# EAGLE schematic logika (EAGLE 7.2.0)
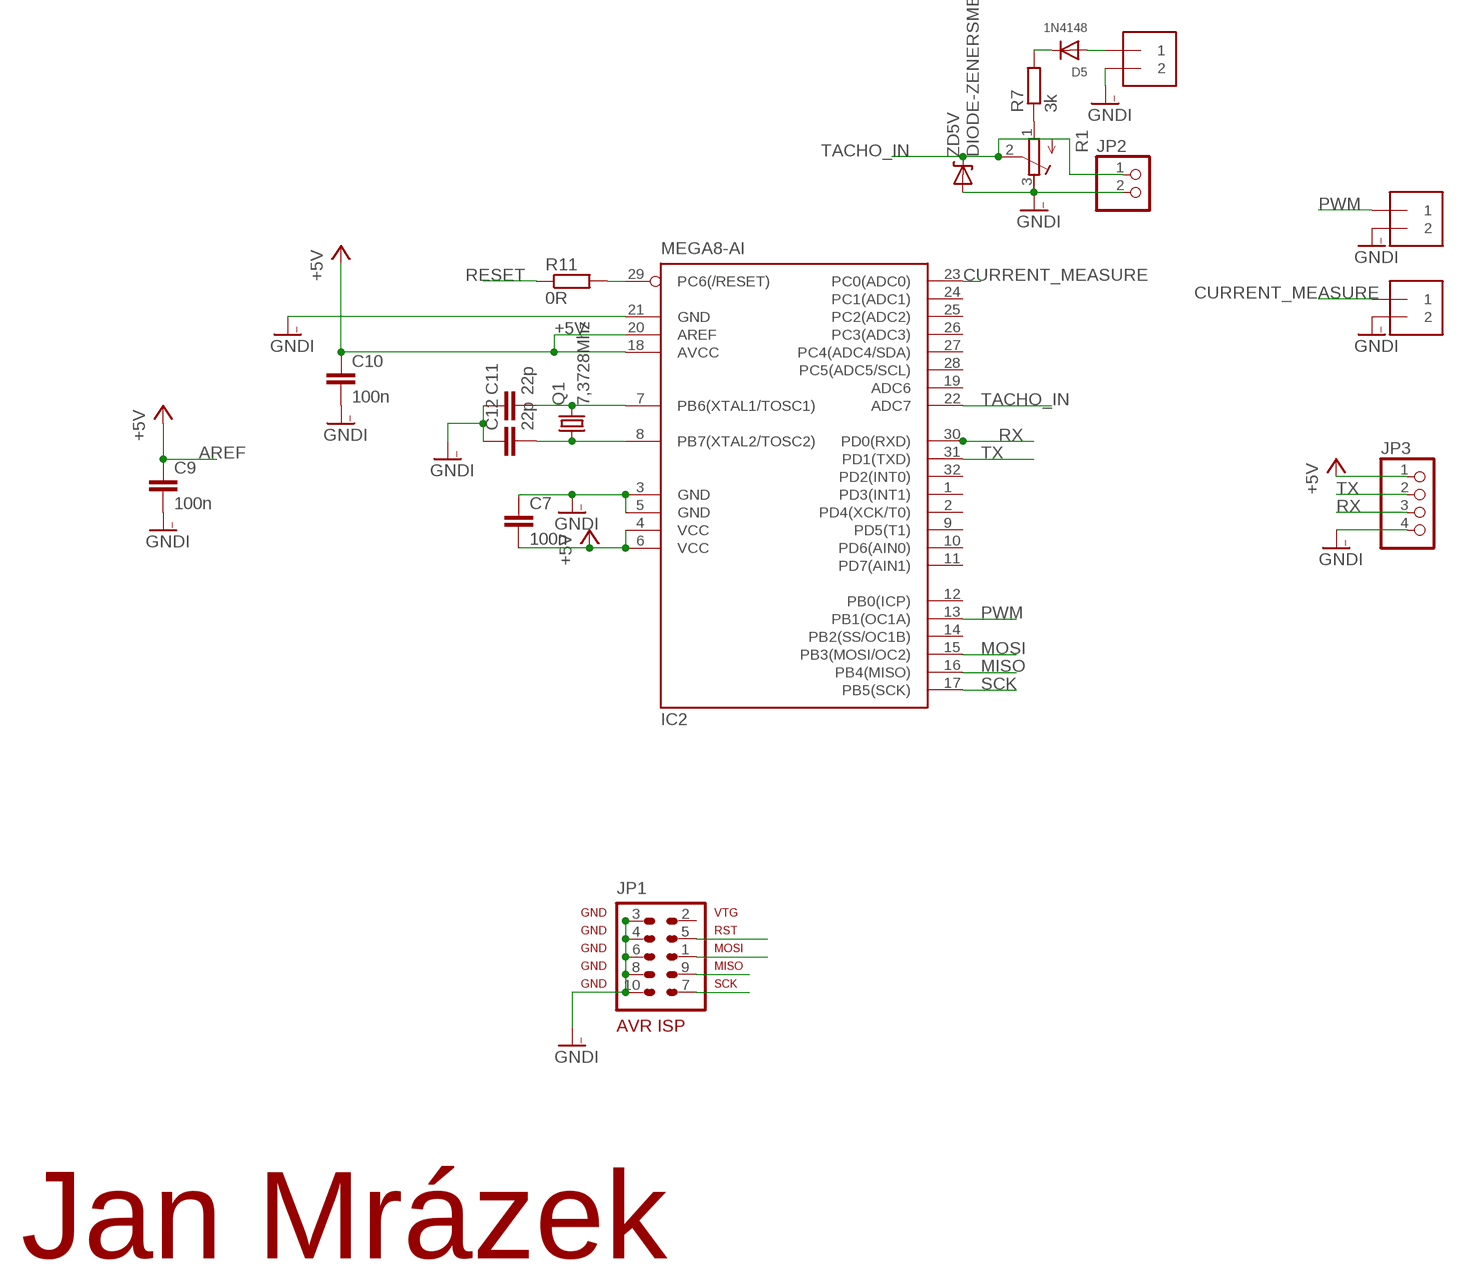
[diagram p0: schematic, sheet 1]

## Parts
C7  100n  C-EUC0603  [C0603]
C9  100n  C-EUC0603  [C0603]
C10  100n  C-EUC0603  [C0603]
C11  22p  C-EUC0603  [C0603]
C12  22p  C-EUC0603  [C0603]
CURRENT  1X2-3.5MM  [1X2-3.5MM]
D5  1N4148  DIODESMA  [SMADIODE]
IC2  MEGA8-AI  [TQFP32-08]
JP1  AVR-ISP-10  [AVR-ISP-10]
JP2  PINHD-1X2  [1X02]
JP3  PINHD-1X4  [1X04]
PWM  1X2-3.5MM  [1X2-3.5MM]
Q1  7,3728Mhz  CRYSTALHC49U-V  [HC49U-V]
R1  R-TRIMM64W  [RTRIM64W]
R7  3k  R-EU_R0603  [R0603]
R11  0R  R-EU_R0603  [R0603]
TACHO_IN  1X2-3.5MM  [1X2-3.5MM]
U$1  LOGOAA  [LOGO5X5]
ZD5V  DIODE-ZENERSMB  [SMB-DIODE]

## Nets
+5V: C7.2 C10.1 IC2.4(VCC) IC2.6(VCC) IC2.18(AVCC) IC2.20(AREF) JP3.1
AREF: C9.1 ; supply symbol labelled +5V
CURRENT_MEASURE: CURRENT.1 IC2.23(PC0(ADC0))
GNDI: C7.1 C9.2 C10.2 C11.1 C12.1 CURRENT.2 IC2.3(GND) IC2.5(GND) IC2.21(GND) JP1.3 JP1.4 JP1.6 JP1.8 JP1.10 JP2.2 JP3.4 PWM.2 R1.3(E) TACHO_IN.2 ZD5V.A
MISO: IC2.16(PB4(MISO)) JP1.9
MOSI: IC2.15(PB3(MOSI/OC2)) JP1.1
N$1: R1.1(A) R7.1
N$10: C11.2 IC2.7(PB6(XTAL1/TOSC1)) Q1.2
N$12: C12.2 IC2.8(PB7(XTAL2/TOSC2)) Q1.1
N$15: D5.A TACHO_IN.1
N$17: IC2.29(PC6(/RESET)) R11.2
N$19: D5.C R7.2
PWM: IC2.13(PB1(OC1A)) PWM.1
RESET: JP1.5 R11.1
RX: IC2.30(PD0(RXD)) JP3.3
SCK: IC2.17(PB5(SCK)) JP1.7
TACHO_IN: IC2.22(ADC7) JP2.1 R1.2(S) ZD5V.C
TX: IC2.31(PD1(TXD)) JP3.2
Unconnected: IC2.1(PD3(INT1)) IC2.2(PD4(XCK/T0)) IC2.9(PD5(T1)) IC2.10(PD6(AIN0)) IC2.11(PD7(AIN1)) IC2.12(PB0(ICP)) IC2.14(PB2(SS/OC1B)) IC2.19(ADC6) IC2.24(PC1(ADC1)) IC2.25(PC2(ADC2)) IC2.26(PC3(ADC3)) IC2.27(PC4(ADC4/SDA)) IC2.28(PC5(ADC5/SCL)) IC2.32(PD2(INT0)) JP1.2

## Library data of the parts
C7 C9-C12 = resistor:C-EU: CAPACITOR, European symbol
CURRENT PWM TACHO_IN = adafruit:1X2: 3.5mm Terminal block http://www.ladyada.net/library/pcb/eaglelibrary.html
D5 = adafruit:DIODE: Diode SMADIODE - SMA Surface Mount Package 20V 1A Schottky Diode Digikey: 641-1014-6-ND DO-1N4148 - Through Hole Small Current Diode SOD-123 20V 1 A (.5mV Vf) Schottky Diode - Digikey: MBRX120TPMSCT-ND SOD-323 10V 570mA (.38mV Vf, 3ns) Schottky Diode - Digikey: ZLLS410CT-ND SOD-523 30V 30mA Schottky Diode (RB751S-40TE61) - Digikey: RB751S-40TE61CT-ND SOT23-R/W - SOT23 Package (R = Solder Paste/Reflow Ovens, W = Hand-Soldering) BAT54Film 40V 300mA - Digikey: 497-7162-1-ND
IC2 = atmel:MEGA8: MICROCONTROLLER 8 Kbytes FLASH, 1 kbytes SRAM, 512 bytes EEPROM, USART, 6-channel 10 bit ADC, 2-channel 8 bit ADC Pin compatible with Atmega48, ATMega88, ATMega168 Source: avr.lbr; MPN: ATMEGA8-16AU; OC_FARNELL: 9171371; OC_NEWARK: 73M8863
JP1 = avr-7:AVR-ISP-10: AVR ISP-10 Serial Programming Header
JP2 = pinhead:PINHD-1X2: PIN HEADER
JP3 = pinhead:PINHD-1X4: PIN HEADER
Q1 = crystal:CRYSTAL: CRYSTAL; OC_FARNELL: 1666969; OC_NEWARK: unknown
R1 = resistor:R-TRIMM: Trimm resistor
R7 R11 = resistor:R-EU_: RESISTOR, European symbol
U$1 = _moje:LOGO
ZD5V = SparkFun-DiscreteSemi:DIODE-ZENER: Zener Diode Production Part - 8199 3.4V Zener Voltage